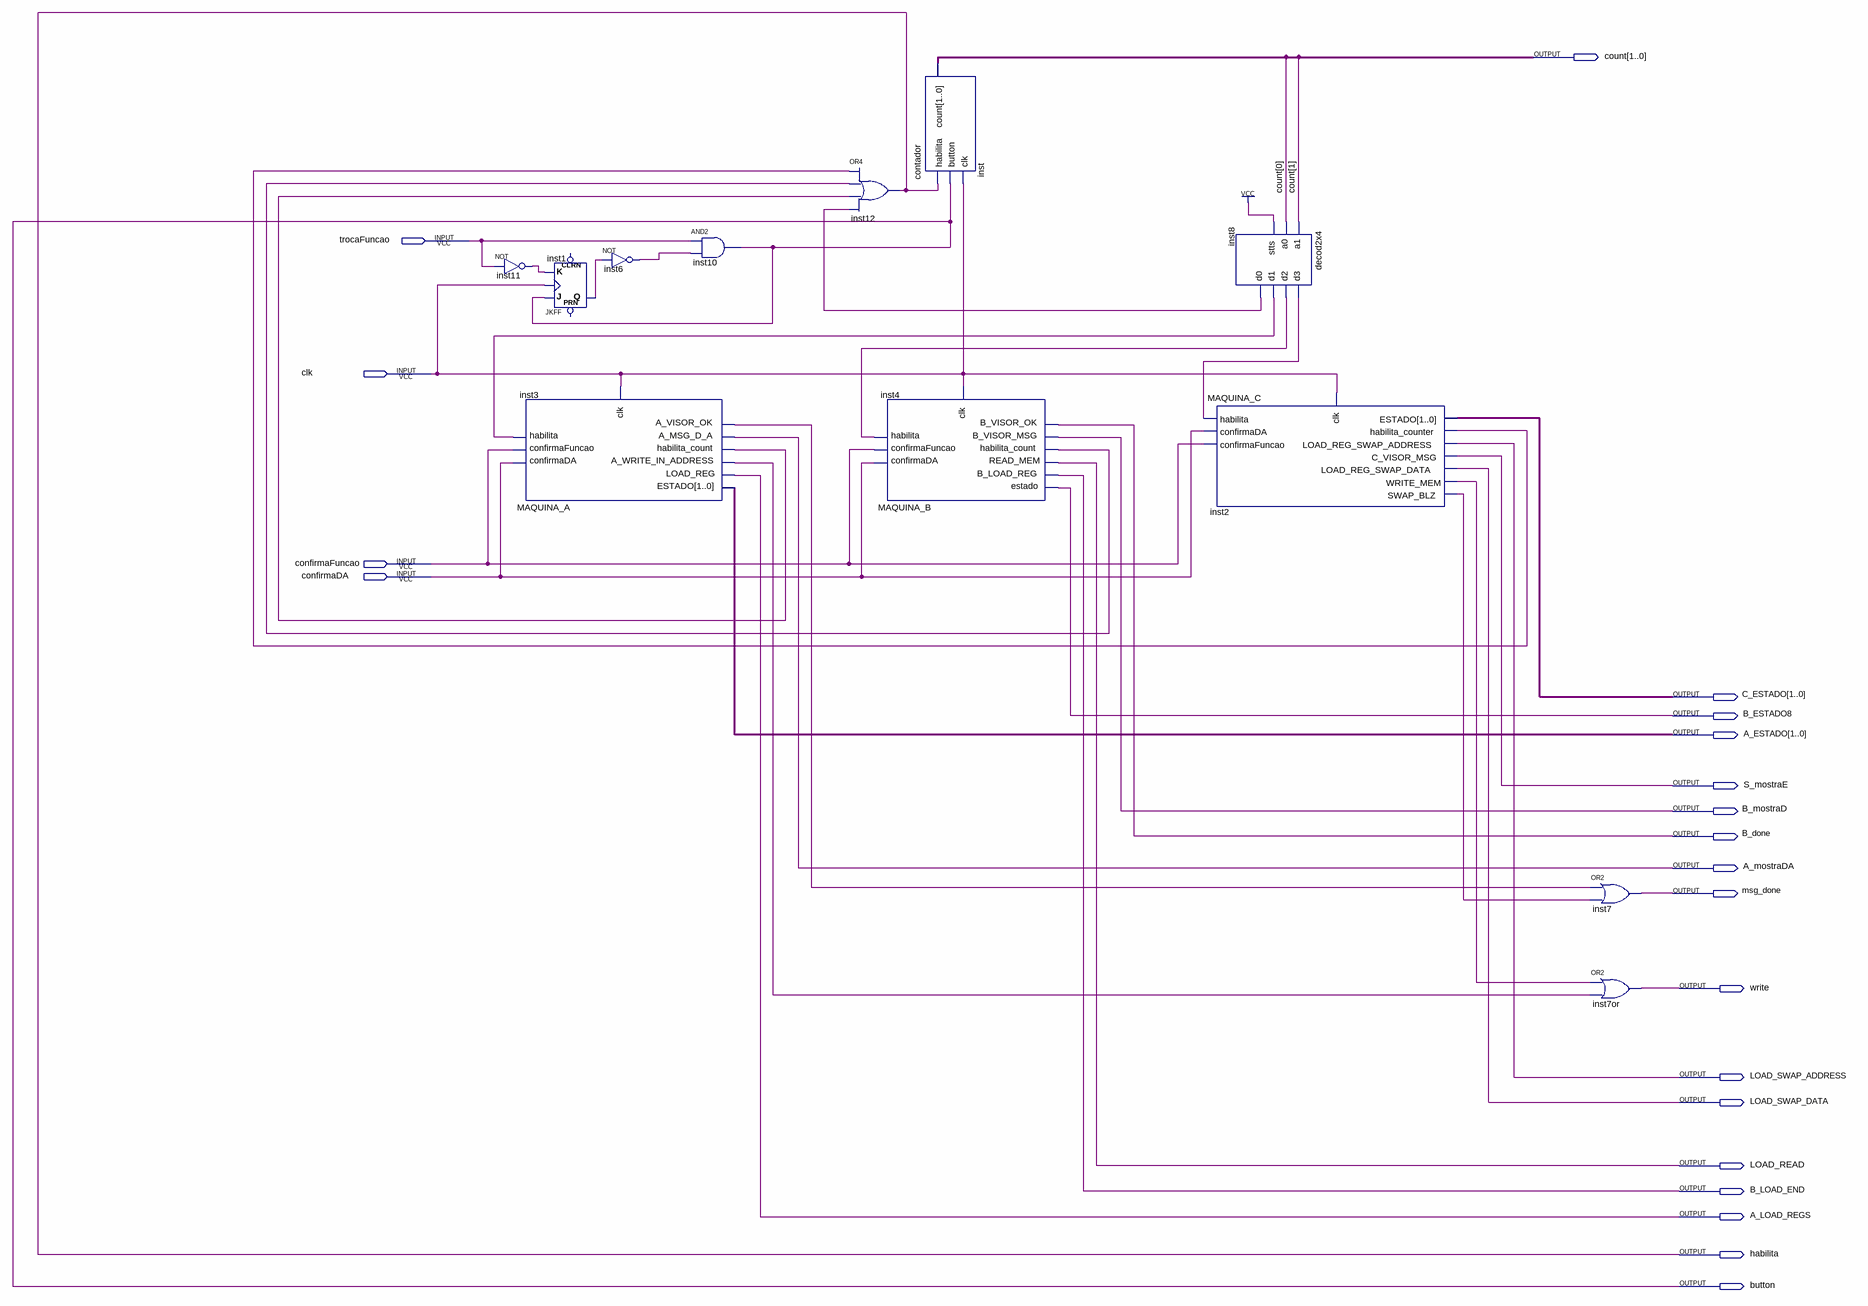
[diagram p0: schematic sheet]
// Quartus schematic UC.bdf as structural Verilog: 12 symbols, 21 pins
module UC (
  input  trocaFuncao,
  input  clk,
  input  confirmaFuncao,
  input  confirmaDA,
  output [1:0] count,
  output [1:0] C_ESTADO,
  output B_ESTADO8,
  output [1:0] A_ESTADO,
  output S_mostraE,
  output B_mostraD,
  output B_done,
  output A_mostraDA,
  output msg_done,
  output write,
  output LOAD_SWAP_ADDRESS,
  output LOAD_SWAP_DATA,
  output LOAD_READ,
  output B_LOAD_END,
  output A_LOAD_REGS,
  output habilita,
  output button
);

  wire inst1_q, inst2_habilita_counter, inst2_swap_blz, inst2_write_mem, inst3_a_visor_ok,
       inst3_a_write_in_address, inst3_habilita_count, inst4_habilita_count, inst6_out, inst8_d0, inst8_d1,
       inst8_d2, inst8_d3, inst11_out;

  not inst11 (inst11_out, trocaFuncao);
  JKFF inst1 (.K(inst11_out), .J(button), .CLK(clk), .Q(inst1_q));  // open: PRN, CLRN
  MAQUINA_A inst3 (
    .habilita(inst8_d1), .clk(clk), .confirmaDA(confirmaDA), .confirmaFuncao(confirmaFuncao),
    .ESTADO(A_ESTADO), .habilita_count(inst3_habilita_count), .A_MSG_D_A(A_mostraDA), .LOAD_REG(A_LOAD_REGS),
    .A_WRITE_IN_ADDRESS(inst3_a_write_in_address), .A_VISOR_OK(inst3_a_visor_ok));
  not inst6 (inst6_out, inst1_q);
  and inst10 (button, trocaFuncao, inst6_out);
  or inst12 (habilita, inst2_habilita_counter, inst4_habilita_count, inst3_habilita_count, inst8_d0);
  MAQUINA_B inst4 (
    .habilita(inst8_d2), .clk(clk), .confirmaDA(confirmaDA), .confirmaFuncao(confirmaFuncao),
    .estado(B_ESTADO8), .B_LOAD_REG(B_LOAD_END), .READ_MEM(LOAD_READ), .habilita_count(inst4_habilita_count),
    .B_VISOR_MSG(B_mostraD), .B_VISOR_OK(B_done));
  contador inst (.habilita(habilita), .button(button), .clk(clk), .count(count));
  MAQUINA_C inst2 (
    .clk(clk), .confirmaDA(confirmaDA), .confirmaFuncao(confirmaFuncao), .habilita(inst8_d3),
    .ESTADO(C_ESTADO), .habilita_counter(inst2_habilita_counter), .LOAD_REG_SWAP_ADDRESS(LOAD_SWAP_ADDRESS),
    .C_VISOR_MSG(S_mostraE), .LOAD_REG_SWAP_DATA(LOAD_SWAP_DATA), .WRITE_MEM(inst2_write_mem),
    .SWAP_BLZ(inst2_swap_blz));
  decod2x4 inst8 (
    .a1(count[1]), .a0(count[0]), .stts(1'b1), .d3(inst8_d3), .d2(inst8_d2), .d1(inst8_d1), .d0(inst8_d0));
  or inst7 (msg_done, inst3_a_visor_ok, inst2_swap_blz);
  or inst7or (write, inst2_write_mem, inst3_a_write_in_address);
endmodule
